# EAGLE schematic Board (EAGLE 9.4.2)

## Sheet 1 of 4: Control
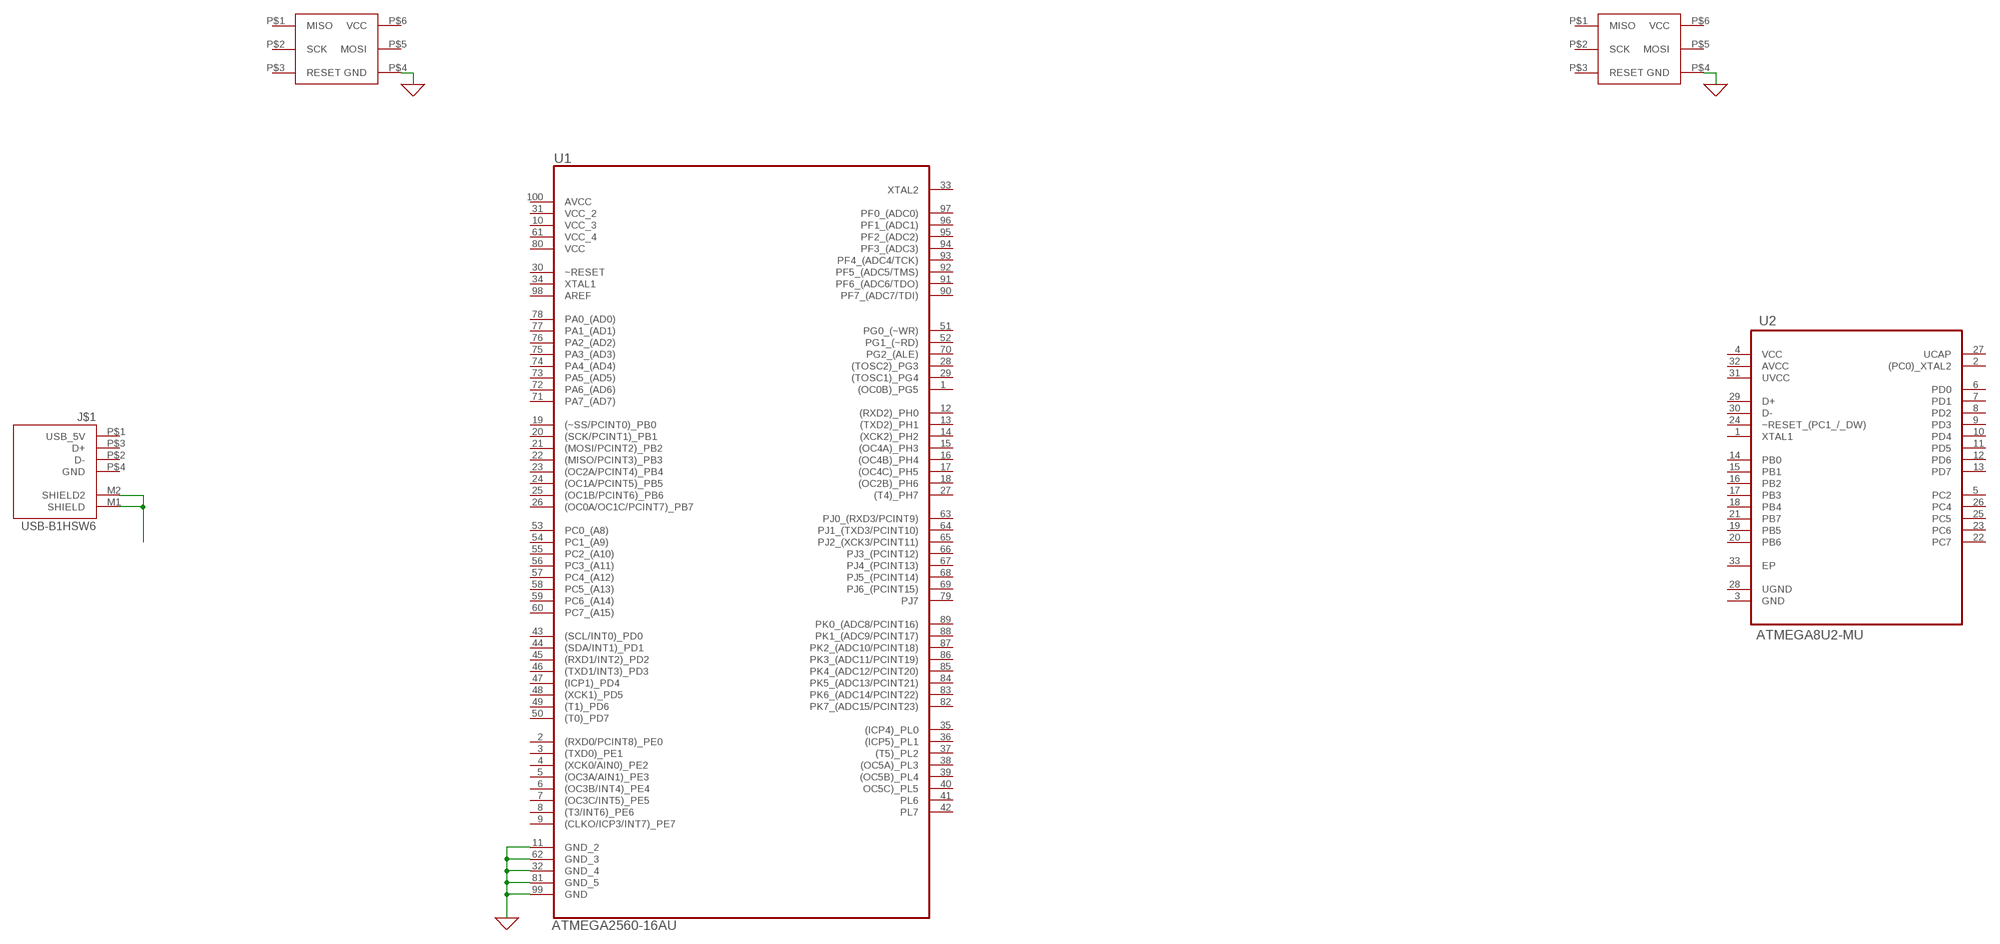
[diagram p0: schematic, sheet 1]

### Parts
J$1  USB-B1HSW6  [USB-B1HSW6]
U1  ATMEGA2560-16AU  [QFP50P1600X1600X120-100N]
U2  ATMEGA8U2-MU  [QFN50P500X500X100-33N]
U$5  ICSP_HDR  [2X3_.1"]
U$6  ICSP_HDR  [2X3_.1"]

### Nets
0: U1.11(GND_2) U1.32(GND_4) U1.62(GND_3) U1.81(GND_5) U1.99(GND) U$5.P$4(GND) U$6.P$4(GND) ; supply symbol labelled GND ; also sheet 2
N$3: J$1.M1(SHIELD) J$1.M2(SHIELD2)
Unconnected: J$1.P$1(USB_5V) J$1.P$2(D-) J$1.P$3(D+) J$1.P$4(GND) U1.1((OC0B)_PG5) U1.2((RXD0/PCINT8)_PE0) U1.3((TXD0)_PE1) U1.4((XCK0/AIN0)_PE2) U1.5((OC3A/AIN1)_PE3) U1.6((OC3B/INT4)_PE4) U1.7((OC3C/INT5)_PE5) U1.8((T3/INT6)_PE6) U1.9((CLKO/ICP3/INT7)_PE7) U1.12((RXD2)_PH0) U1.13((TXD2)_PH1) U1.14((XCK2)_PH2) U1.15((OC4A)_PH3) U1.16((OC4B)_PH4) U1.17((OC4C)_PH5) U1.18((OC2B)_PH6) U1.19((~SS/PCINT0)_PB0) U1.20((SCK/PCINT1)_PB1) U1.21((MOSI/PCINT2)_PB2) U1.22((MISO/PCINT3)_PB3) U1.23((OC2A/PCINT4)_PB4) U1.24((OC1A/PCINT5)_PB5) U1.25((OC1B/PCINT6)_PB6) U1.26((OC0A/OC1C/PCINT7)_PB7) U1.27((T4)_PH7) U1.28((TOSC2)_PG3) U1.29((TOSC1)_PG4) U1.30(~RESET) U1.33(XTAL2) U1.34(XTAL1) U1.35((ICP4)_PL0) U1.36((ICP5)_PL1) U1.37((T5)_PL2) U1.38((OC5A)_PL3) U1.39((OC5B)_PL4) U1.40(OC5C)_PL5) U1.41(PL6) U1.42(PL7) U1.43((SCL/INT0)_PD0) U1.44((SDA/INT1)_PD1) U1.45((RXD1/INT2)_PD2) U1.46((TXD1/INT3)_PD3) U1.47((ICP1)_PD4) U1.48((XCK1)_PD5) U1.49((T1)_PD6) U1.50((T0)_PD7) U1.51(PG0_(~WR)) U1.52(PG1_(~RD)) U1.53(PC0_(A8)) U1.54(PC1_(A9)) U1.55(PC2_(A10)) U1.56(PC3_(A11)) U1.57(PC4_(A12)) U1.58(PC5_(A13)) U1.59(PC6_(A14)) U1.60(PC7_(A15)) U1.63(PJ0_(RXD3/PCINT9)) U1.64(PJ1_(TXD3/PCINT10)) U1.65(PJ2_(XCK3/PCINT11)) U1.66(PJ3_(PCINT12)) U1.67(PJ4_(PCINT13)) U1.68(PJ5_(PCINT14)) U1.69(PJ6_(PCINT15)) U1.70(PG2_(ALE)) U1.71(PA7_(AD7)) U1.72(PA6_(AD6)) U1.73(PA5_(AD5)) U1.74(PA4_(AD4)) U1.75(PA3_(AD3)) U1.76(PA2_(AD2)) U1.77(PA1_(AD1)) U1.78(PA0_(AD0)) U1.79(PJ7) U1.82(PK7_(ADC15/PCINT23)) U1.83(PK6_(ADC14/PCINT22)) U1.84(PK5_(ADC13/PCINT21)) U1.85(PK4_(ADC12/PCINT20)) U1.86(PK3_(ADC11/PCINT19)) U1.87(PK2_(ADC10/PCINT18)) U1.88(PK1_(ADC9/PCINT17)) U1.89(PK0_(ADC8/PCINT16)) U1.90(PF7_(ADC7/TDI)) U1.91(PF6_(ADC6/TDO)) U1.92(PF5_(ADC5/TMS)) U1.93(PF4_(ADC4/TCK)) U1.94(PF3_(ADC3)) U1.95(PF2_(ADC2)) U1.96(PF1_(ADC1)) U1.97(PF0_(ADC0)) U1.98(AREF) U2.1(XTAL1) U2.2((PC0)_XTAL2) U2.3(GND) U2.5(PC2) U2.6(PD0) U2.7(PD1) U2.8(PD2) U2.9(PD3) U2.10(PD4) U2.11(PD5) U2.12(PD6) U2.13(PD7) U2.14(PB0) U2.15(PB1) U2.16(PB2) U2.17(PB3) U2.18(PB4) U2.19(PB5) U2.20(PB6) U2.21(PB7) U2.22(PC7) U2.23(PC6) U2.24(~RESET_(PC1_/_DW)) U2.25(PC5) U2.26(PC4) U2.28(UGND) U2.29(D+) U2.30(D-) U2.33(EP) U$5.P$1(MISO) U$5.P$2(SCK) U$5.P$3(RESET) U$5.P$5(MOSI) U$5.P$6(VCC) U$6.P$1(MISO) U$6.P$2(SCK) U$6.P$3(RESET) U$6.P$5(MOSI) U$6.P$6(VCC)

## Sheet 2 of 4: Power
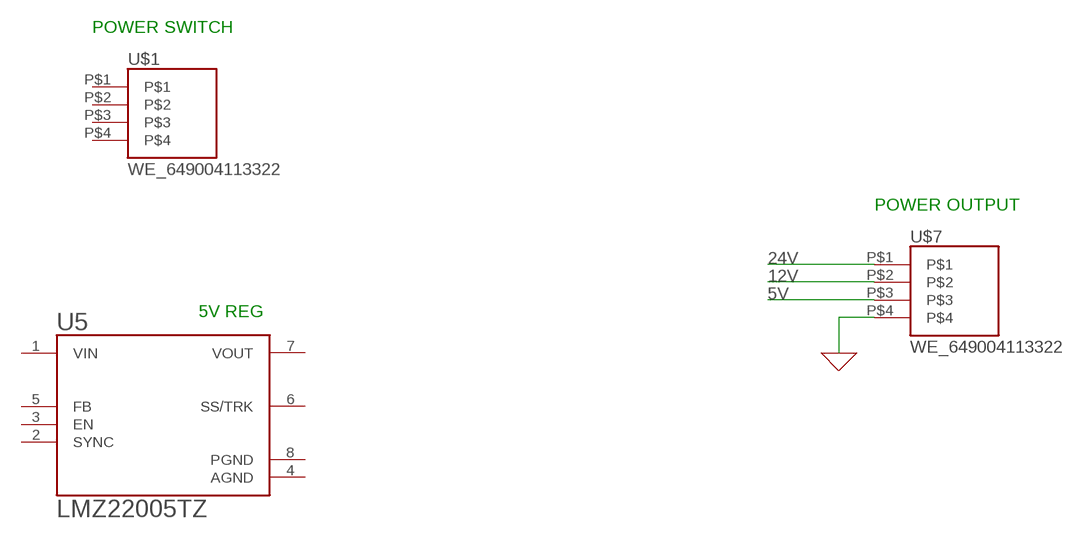
[diagram p1: schematic, sheet 2]

### Parts
U5  LMZ22005TZ  [DPAK127P1377X467-8N]
U$1  WE_649004113322  [WE_649004113322]
U$7  WE_649004113322  [WE_649004113322]

### Nets
0: U$7.P$4 ; supply symbol labelled GND ; also sheet 1
5V: U$7.P$3
12V: U$7.P$2
24V: U$7.P$1
Unconnected: U5.1(VIN) U5.2(SYNC) U5.3(EN) U5.5(FB) U5.6(SS/TRK) U5.7(VOUT) U$1.P$1 U$1.P$2 U$1.P$3 U$1.P$4

### Notes on the sheet
- POWER SWITCH
- POWER OUTPUT
- 5V REG

## Sheet 3 of 4: Stepper Motor Drivers
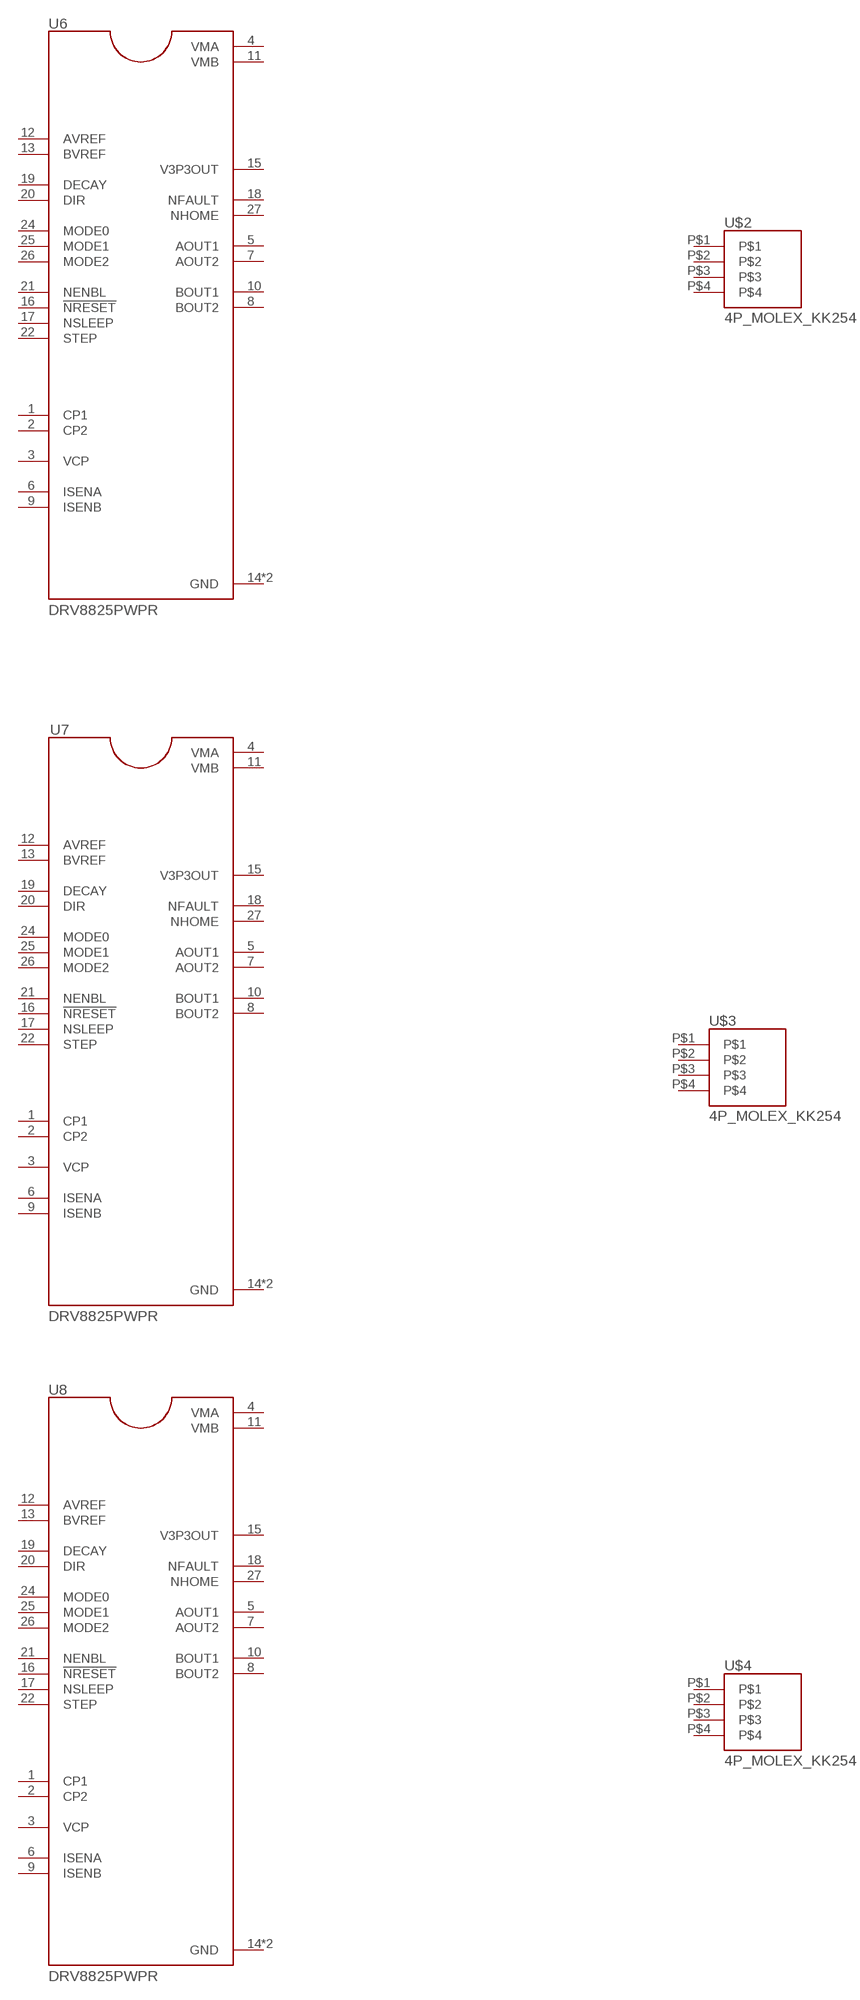
[diagram p2: schematic, sheet 3]

### Parts
U6  DRV8825PWPR  [SOP65P640X120-28N]
U7  DRV8825PWPR  [SOP65P640X120-28N]
U8  DRV8825PWPR  [SOP65P640X120-28N]
U$2  4P_MOLEX_KK254  [4P_MOLEX_KK254]
U$3  4P_MOLEX_KK254  [4P_MOLEX_KK254]
U$4  4P_MOLEX_KK254  [4P_MOLEX_KK254]
Unconnected: U6.1(CP1) U6.2(CP2) U6.3(VCP) U6.5(AOUT1) U6.6(ISENA) U6.7(AOUT2) U6.8(BOUT2) U6.9(ISENB) U6.10(BOUT1) U6.12(AVREF) U6.13(BVREF) U6.14(GND) U6.15(V3P3OUT) U6.16(!NRESET) U6.17(NSLEEP) U6.18(NFAULT) U6.19(DECAY) U6.20(DIR) U6.21(NENBL) U6.22(STEP) U6.24(MODE0) U6.25(MODE1) U6.26(MODE2) U6.27(NHOME) U6.28(GND) U7.1(CP1) U7.2(CP2) U7.3(VCP) U7.5(AOUT1) U7.6(ISENA) U7.7(AOUT2) U7.8(BOUT2) U7.9(ISENB) U7.10(BOUT1) U7.12(AVREF) U7.13(BVREF) U7.14(GND) U7.15(V3P3OUT) U7.16(!NRESET) U7.17(NSLEEP) U7.18(NFAULT) U7.19(DECAY) U7.20(DIR) U7.21(NENBL) U7.22(STEP) U7.24(MODE0) U7.25(MODE1) U7.26(MODE2) U7.27(NHOME) U7.28(GND) U8.1(CP1) U8.2(CP2) U8.3(VCP) U8.5(AOUT1) U8.6(ISENA) U8.7(AOUT2) U8.8(BOUT2) U8.9(ISENB) U8.10(BOUT1) U8.12(AVREF) U8.13(BVREF) U8.14(GND) U8.15(V3P3OUT) U8.16(!NRESET) U8.17(NSLEEP) U8.18(NFAULT) U8.19(DECAY) U8.20(DIR) U8.21(NENBL) U8.22(STEP) U8.24(MODE0) U8.25(MODE1) U8.26(MODE2) U8.27(NHOME) U8.28(GND) U$2.P$1 U$2.P$2 U$2.P$3 U$2.P$4 U$3.P$1 U$3.P$2 U$3.P$3 U$3.P$4 U$4.P$1 U$4.P$2 U$4.P$3 U$4.P$4

## Sheet 4 of 4: Tool Passthrough
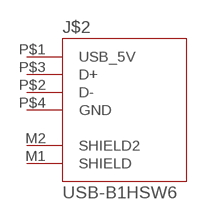
[diagram p3: schematic, sheet 4]

### Parts
J$2  USB-B1HSW6  [USB-B1HSW6]
Unconnected: J$2.M1(SHIELD) J$2.M2(SHIELD2) J$2.P$1(USB_5V) J$2.P$2(D-) J$2.P$3(D+) J$2.P$4(GND)

## Power pins joined to a net without a drawn wire
AGND: U5.4(AGND)
AVCC: U1.100(AVCC) U2.32(AVCC)
PGND: U5.8(PGND)
UCAP: U2.27(UCAP)
UVCC: U2.31(UVCC)
VCC: U1.80(VCC) U2.4(VCC)
VCC_2: U1.31(VCC_2)
VCC_3: U1.10(VCC_3)
VCC_4: U1.61(VCC_4)
VMA: U6.4(VMA) U7.4(VMA) U8.4(VMA)
VMB: U6.11(VMB) U7.11(VMB) U8.11(VMB)

## Library data of the parts
J$1 J$2 = cartesian_main:USB-B1HSW6: http://www.on-shore.com/wp-content/uploads/USB-B1HSXX.pdf
U1 = cartesian_main:ATMEGA2560-16AU: Microcontroller; AVAILABILITY: Unavailable; DESCRIPTION: Embedded microcontroller ATMEGA2560-16AU TQFP 100 _14x14_ Microchip Technology 8-Bit 16 MHz I/O number 86; MF: Microchip; MP: ATMEGA2560-16AU; PACKAGE: TQFP-100 Microchip; PRICE: None
U2 = cartesian_main:ATMEGA8U2-MU: Microcontroller with 8/16/32K Bytes of ISP Flash and USB Controller; AVAILABILITY: Unavailable; DESCRIPTION: ATmega Series 16 MHz 8 KB Flash 512 B SRAM 8-Bit Microcontroller - QFN-32; MF: Microchip; MP: ATMEGA8U2-MU; PACKAGE: VQFN-32 Microchip; PRICE: None
U5 = cartesian_main:LMZ22005TZ: Power Module, 20v, 5a, 7to-Pmod; AVAILABILITY: Unavailable; DESCRIPTION: Power Module, 20v, 5a, 7to-Pmod; MF: Texas Instruments; MP: LMZ22005TZ; PACKAGE: TO-7 Texas Instruments; PRICE: None
U6-U8 = cartesian_main:DRV8825PWPR: DRV8825 Stepper Motor Controller IC; AVAILABILITY: Unavailable; DESCRIPTION: 2.5A Bipolar Stepper Motor Driver with On-Chip 1/32 Microstepping Indexer _Step/Dir Ctrl_ 28-HTSSOP -40 to 85; MF: Texas Instruments; MP: DRV8825PWPR; PACKAGE: HTSSOP-28 Texas Instruments; PRICE: None
U$1 U$7 = cartesian_main:WE_649004113322
U$2-U$4 = cartesian_main:4P_MOLEX_KK254
U$5 U$6 = cartesian_main:ICSP_HDR